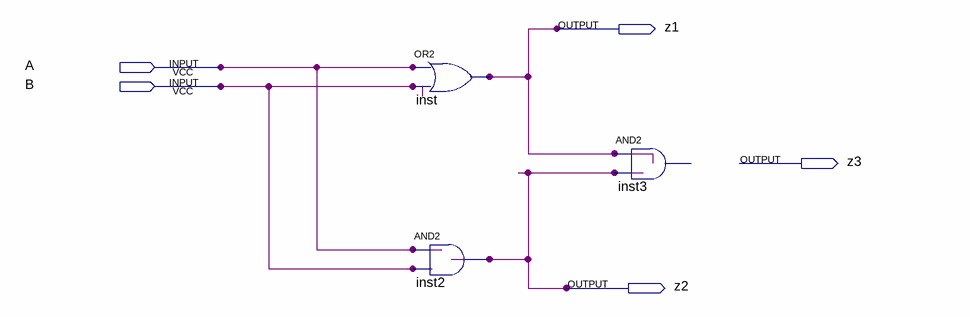
[diagram p0: schematic sheet]
// Quartus schematic Lab2.bdf as structural Verilog: 3 symbols, 5 pins
module Lab2 (
  input  A,
  input  B,
  output z1,
  output z3,
  output z2
);

  or inst (z1, A, B);
  and inst2 (z2, A, B);
  // AND2 inst3 has open pins: IN1=z1, IN2=z2, OUT=open
endmodule
